# EAGLE design PCB-TLY-JACK (EAGLE 7.5.0)

## Sheet 1 of 2
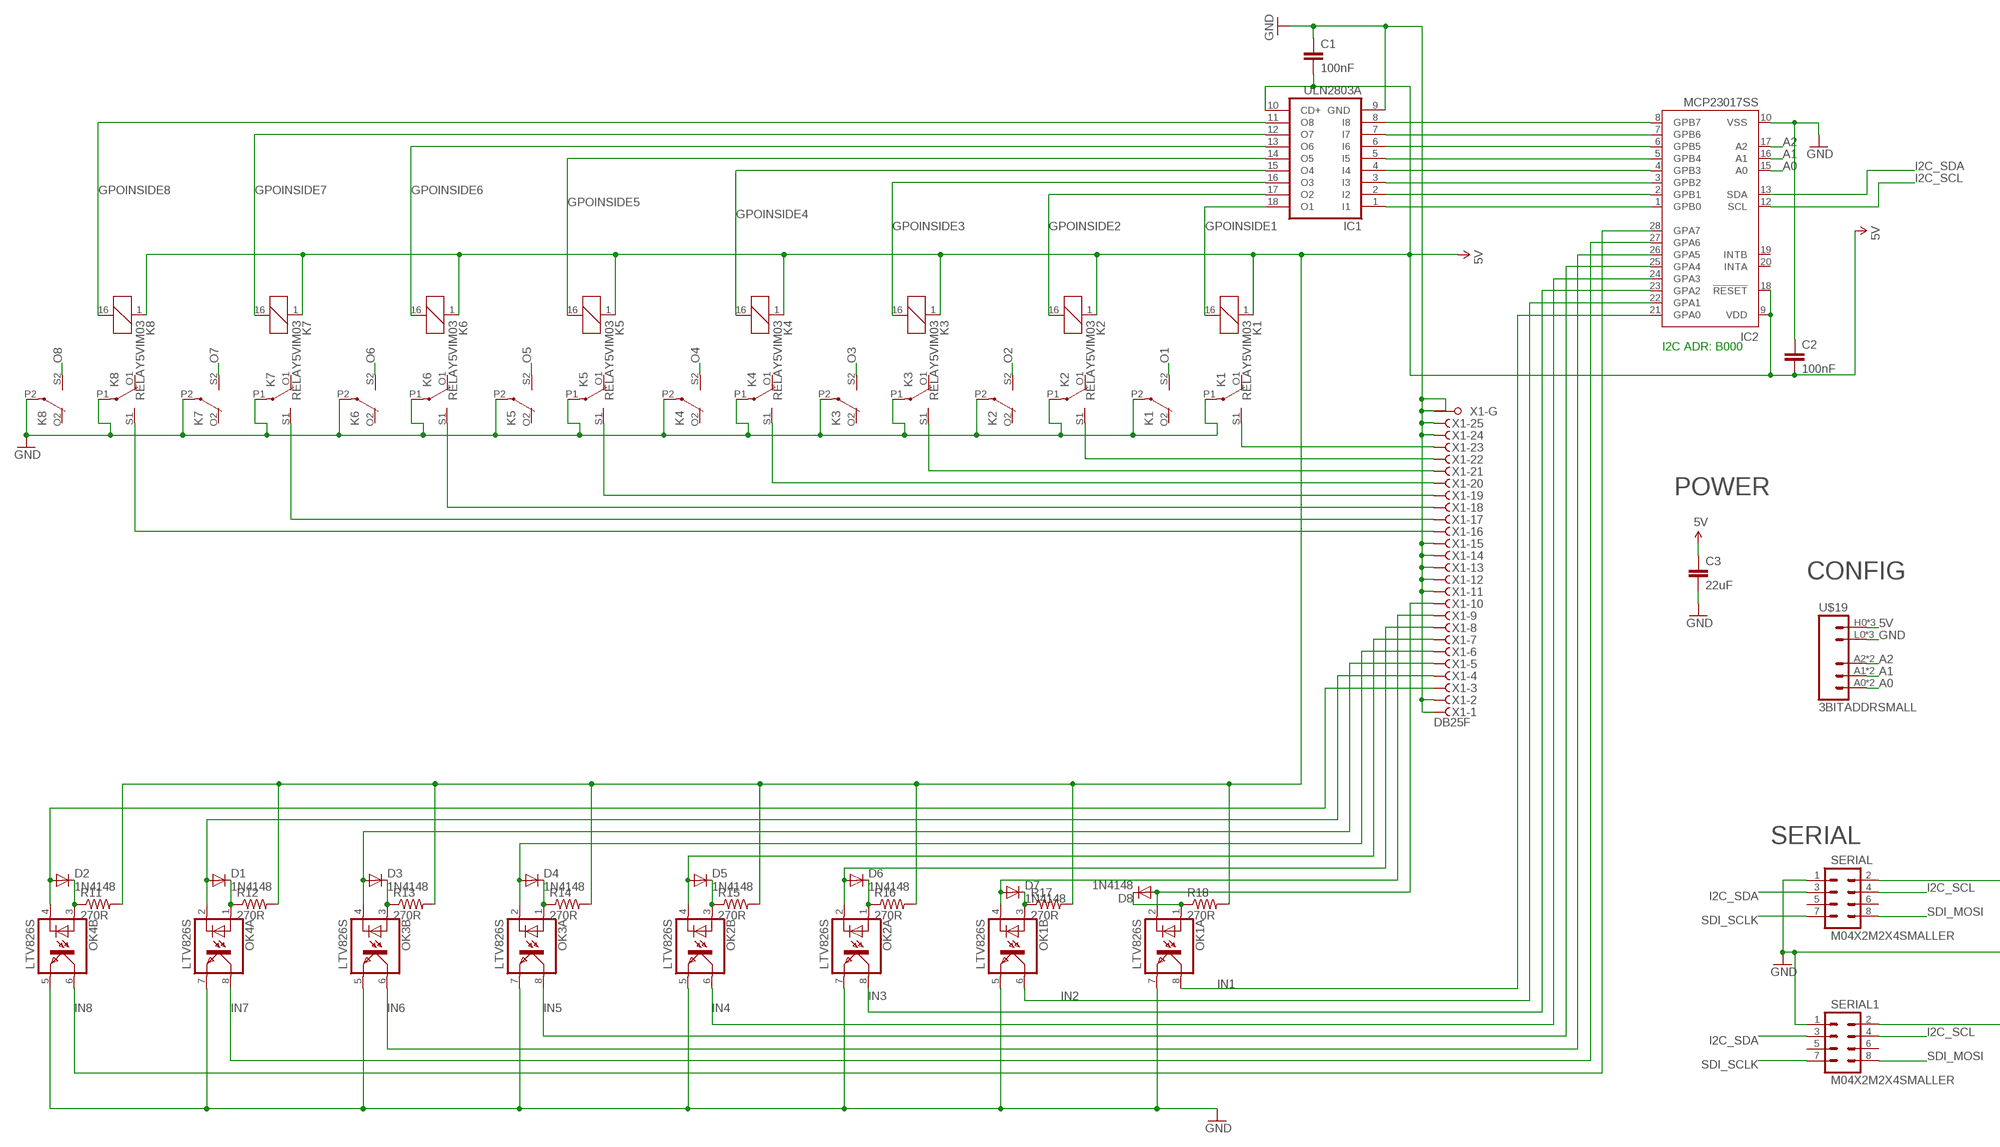
[diagram p0: schematic, sheet 1, part 1 of 2]
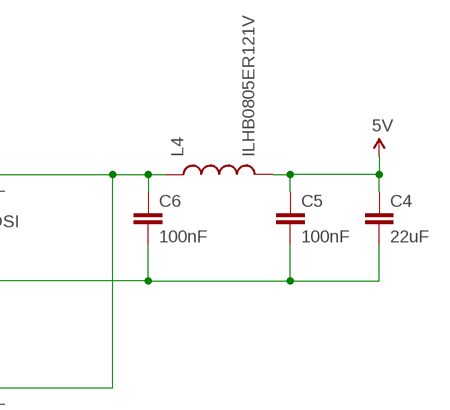
[diagram p1: schematic, sheet 1, part 2 of 2]

### Parts
C1  100nF  CAP0603-CAP  [0603-CAP]
C2  100nF  CAP0603-CAP  [0603-CAP]
C3  22uF  CAP0805  [0805]
C4  22uF  CAP0805  [0805]
C5  100nF  CAP0603-CAP  [0603-CAP]
C6  100nF  CAP0603-CAP  [0603-CAP]
D1  1N4148  DIODESOD  [SOD-323]
D2  1N4148  DIODESOD  [SOD-323]
D3  1N4148  DIODESOD  [SOD-323]
D4  1N4148  DIODESOD  [SOD-323]
D5  1N4148  DIODESOD  [SOD-323]
D6  1N4148  DIODESOD  [SOD-323]
D7  1N4148  DIODESOD  [SOD-323]
D8  1N4148  DIODESOD  [SOD-323]
IC1  ULN2803A  ULN2803ASO18W  [SO18W]
IC2  MCP23017SS  [SSOP28]
K1  RELAY5VIM03  [DS2Y]
K2  RELAY5VIM03  [DS2Y]
K3  RELAY5VIM03  [DS2Y]
K4  RELAY5VIM03  [DS2Y]
K5  RELAY5VIM03  [DS2Y]
K6  RELAY5VIM03  [DS2Y]
K7  RELAY5VIM03  [DS2Y]
K8  RELAY5VIM03  [DS2Y]
L4  ILHB0805ER121V  INDUCTOR0805  [0805]
OK1  LTV826S  [DIL8-SMD]
OK2  LTV826S  [DIL8-SMD]
OK3  LTV826S  [DIL8-SMD]
OK4  LTV826S  [DIL8-SMD]
R11  270R  RESISTOR0603-RES  [0603-RES]
R12  270R  RESISTOR0603-RES  [0603-RES]
R13  270R  RESISTOR0603-RES  [0603-RES]
R14  270R  RESISTOR0603-RES  [0603-RES]
R15  270R  RESISTOR0603-RES  [0603-RES]
R16  270R  RESISTOR0603-RES  [0603-RES]
R17  270R  RESISTOR0603-RES  [0603-RES]
R18  270R  RESISTOR0603-RES  [0603-RES]
SERIAL  M04X2M2X4SMALLER  [M2X4SMALLER]
SERIAL1  M04X2M2X4SMALLER  [M2X4SMALLER]
U$19  3BITADDRSMALL  [3BITADDR_SMALL]
X1  DB25F  F25HPS  [F25HP]

### Nets
5V [Power]: C1.2 C2.2 C3.1 C4.1 C5.1 IC1.10(CD+) IC2.9(VDD) IC2.18(!RESET) K1.1 K2.1 K3.1 K4.1 K5.1 K6.1 K7.1 K8.1 L4.2 R11.2 R12.2 R13.2 R14.2 R15.2 R16.2 R17.2 R18.2 U$19.H0(VCC) U$19.H1(VCC) U$19.H2(VCC)
A0: IC2.15(A0) U$19.A0 U$19.AS0(A0)
A1: IC2.16(A1) U$19.A1 U$19.AS1(A1)
A2: IC2.17(A2) U$19.A2 U$19.AS2(A2)
GND [Power]: C1.1 C2.1 C3.2 C4.2 C5.2 C6.2 IC1.9(GND) IC2.10(VSS) K1.P1(2:P) K1.P2(3:P) K2.P1(2:P) K2.P2(3:P) K3.P1(2:P) K3.P2(3:P) K4.P1(2:P) K4.P2(3:P) K5.P1(2:P) K5.P2(3:P) K6.P1(2:P) K6.P2(3:P) K7.P1(2:P) K7.P2(3:P) K8.P1(2:P) K8.P2(3:P) OK1.5(B:EMIT) OK1.7(A:EMIT) OK2.5(B:EMIT) OK2.7(A:EMIT) OK3.5(B:EMIT) OK3.7(A:EMIT) OK4.5(B:EMIT) OK4.7(A:EMIT) SERIAL1.1 SERIAL.1 U$19.L0(GND) U$19.L1(GND) U$19.L2(GND) X1.1(-1:F) X1.2(-2:F) X1.11(-11:F) X1.12(-12:F) X1.13(-13:F) X1.14(-14:F) X1.15(-15:F) X1.24(-24:F) X1.25(-25:F) X1.G1(-G:G1) X1.G2(-G:G2)
GPOINSIDE1: IC1.18(O1) K1.16
GPOINSIDE2: IC1.17(O2) K2.16
GPOINSIDE3: IC1.16(O3) K3.16
GPOINSIDE4: IC1.15(O4) K4.16
GPOINSIDE5: IC1.14(O5) K5.16
GPOINSIDE6: IC1.13(O6) K6.16
GPOINSIDE7: IC1.12(O7) K7.16
GPOINSIDE8: IC1.11(O8) K8.16
I2C_SCL: IC2.12(SCL) SERIAL1.4 SERIAL.4
I2C_SDA: IC2.13(SDA) SERIAL1.3 SERIAL.3
IN1: IC2.21(GPA0) OK1.8(A:COL)
IN2: IC2.22(GPA1) OK1.6(B:COL)
IN3: IC2.23(GPA2) OK2.8(A:COL)
IN4: IC2.24(GPA3) OK2.6(B:COL)
IN5: IC2.25(GPA4) OK3.8(A:COL)
IN6: IC2.26(GPA5) OK3.6(B:COL)
IN7: IC2.27(GPA6) OK4.8(A:COL)
IN8: IC2.28(GPA7) OK4.6(B:COL)
N$1 [RELAY LINES]: K1.S1(2:S) X1.23(-23:F)
N$2 [Power]: C6.1 L4.1 SERIAL1.2 SERIAL.2
N$5: IC1.1(I1) IC2.1(GPB0)
N$6 [RELAY LINES]: K2.S1(2:S) X1.22(-22:F)
N$10 [RELAY LINES]: K3.S1(2:S) X1.21(-21:F)
N$13: D2.1(C) OK4.3(B:A) R11.1
N$14 [RELAY LINES]: K4.S1(2:S) X1.20(-20:F)
N$15: D1.1(C) OK4.1(A:A) R12.1
N$16: D3.1(C) OK3.3(B:A) R13.1
N$17: D4.1(C) OK3.1(A:A) R14.1
N$18 [RELAY LINES]: K5.S1(2:S) X1.19(-19:F)
N$19: D5.1(C) OK2.3(B:A) R15.1
N$20: D6.1(C) OK2.1(A:A) R16.1
N$21: D7.1(C) OK1.3(B:A) R17.1
N$22 [RELAY LINES]: K6.S1(2:S) X1.18(-18:F)
N$23: D8.1(C) OK1.1(A:A) R18.1
N$26 [RELAY LINES]: K7.S1(2:S) X1.17(-17:F)
N$30 [RELAY LINES]: K8.S1(2:S) X1.16(-16:F)
N$34: IC1.2(I2) IC2.2(GPB1)
N$35: IC1.3(I3) IC2.3(GPB2)
N$36: IC1.4(I4) IC2.4(GPB3)
N$37: IC1.5(I5) IC2.5(GPB4)
N$38: IC1.6(I6) IC2.6(GPB5)
N$39: IC1.7(I7) IC2.7(GPB6)
N$40: IC1.8(I8) IC2.8(GPB7)
N$49 [INput lines]: D8.2(A) OK1.2(A:C) X1.10(-10:F)
N$55 [INput lines]: D4.2(A) OK3.2(A:C) X1.6(-6:F)
N$60 [INput lines]: D7.2(A) OK1.4(B:C) X1.9(-9:F)
N$61 [INput lines]: D6.2(A) OK2.2(A:C) X1.8(-8:F)
N$62 [INput lines]: D5.2(A) OK2.4(B:C) X1.7(-7:F)
N$64 [INput lines]: D3.2(A) OK3.4(B:C) X1.5(-5:F)
N$65 [INput lines]: D1.2(A) OK4.2(A:C) X1.4(-4:F)
N$66 [INput lines]: D2.2(A) OK4.4(B:C) X1.3(-3:F)
O1: K1.S2(3:S)
O2: K2.S2(3:S)
O3: K3.S2(3:S)
O4: K4.S2(3:S)
O5: K5.S2(3:S)
O6: K6.S2(3:S)
O7: K7.S2(3:S)
O8: K8.S2(3:S)
SDI_MOSI: SERIAL1.8 SERIAL.8
SDI_SCLK: SERIAL1.7 SERIAL.7
Unconnected: IC2.19(INTB) IC2.20(INTA) K1.O1(2:O) K1.O2(3:O) K2.O1(2:O) K2.O2(3:O) K3.O1(2:O) K3.O2(3:O) K4.O1(2:O) K4.O2(3:O) K5.O1(2:O) K5.O2(3:O) K6.O1(2:O) K6.O2(3:O) K7.O1(2:O) K7.O2(3:O) K8.O1(2:O) K8.O2(3:O) SERIAL1.5 SERIAL1.6 SERIAL.5 SERIAL.6

### Notes on the sheet
- I2C ADR: B000
- POWER
- CONFIG
- SERIAL

## Sheet 2 of 2

## Library data of the parts
C1-C6 = SparkFun:CAP: Capacitor Standard 0603 ceramic capacitor, and 0.1" leaded capacitor.
D1-D8 = SparkFun:DIODE: Diode These are standard reverse protection diodes and small signal diodes. SMA package can handle up to about 1A. SOD-323 can handle about 200mA. What the SOD-323 package when ordering, there are some mfgs out there that are 5-pin packages.
IC1 = uln-udn:ULN2803A: DRIVER ARRAY
IC2 = microchip:MCP23017: http://ww1.microchip.com/downloads/en/DeviceDoc/21952a.pdf Source: http://ww1.microchip.com/downloads/en/DeviceDoc/21952a.pdf; MF: MICROCHIP; MPN: MCP23017-E/SS; OC_FARNELL: 1467674; OC_NEWARK: 31K2960
K1-K8 = SKAARHOJ:RELAY5V: RELAY 2 x switch, AxiCom 150 mW 5V
L4 = SparkFun:INDUCTOR: Inductors Basic Inductor/Choke - 0603 and 1206. Footprints are not proven and vary greatly between part numbers.
OK1-OK4 = optocoupler:LTV826: OPTO COUPLER Source: LITEON, LTV816.pdf; OC_FARNELL: unknown; OC_NEWARK: unknown
R11-R18 = SparkFun:RESISTOR: Resistor Basic schematic elements and footprints for 0603, 1206, and PTH resistors.
SERIAL SERIAL1 = SKAARHOJ:M04X2
U$19 = SKAARHOJ:3BITADDR
X1 = con-subd:F25HPS: SUB-D; OC_FARNELL: unknown; OC_NEWARK: unknown

## Net classes
0 default: width 0.203 mm, drill 0.406 mm, clearance 0.203 mm
1 Power: width 0.406 mm, drill 0.61 mm, clearance 0.203 mm
2 RELAY LINES: width 0.305 mm, drill 0.406 mm, clearance 0.254 mm
3 INput lines: width 0.203 mm, drill 0.406 mm, clearance 0.254 mm

## Board
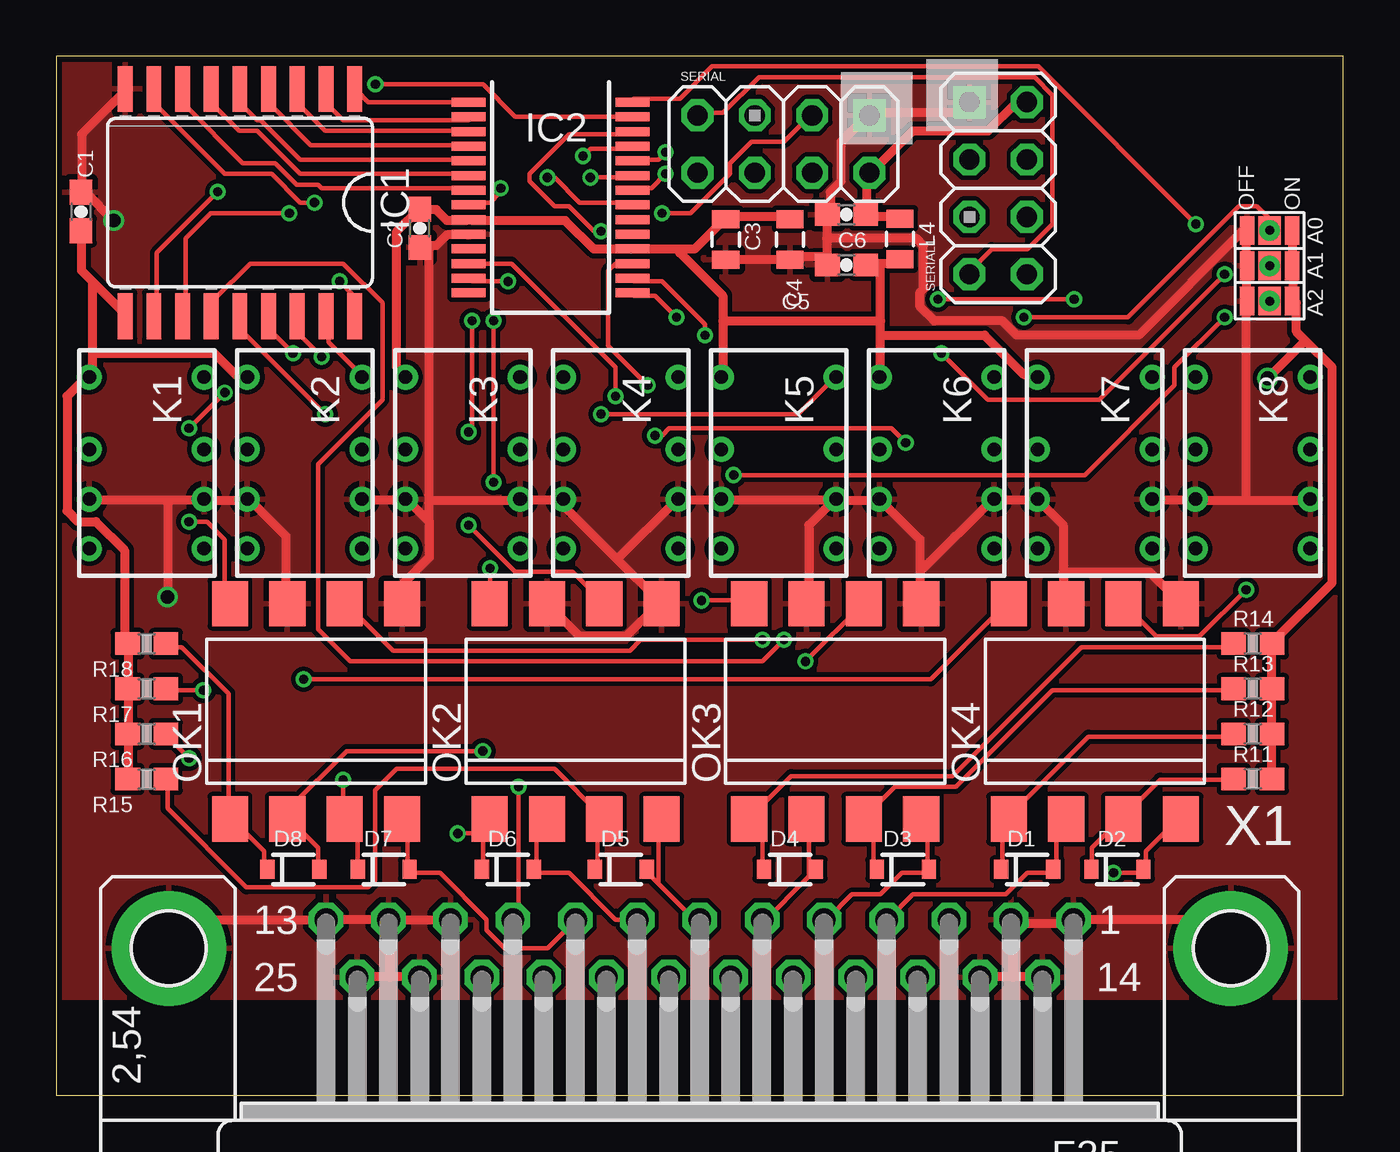
[diagram p2: board, top side]
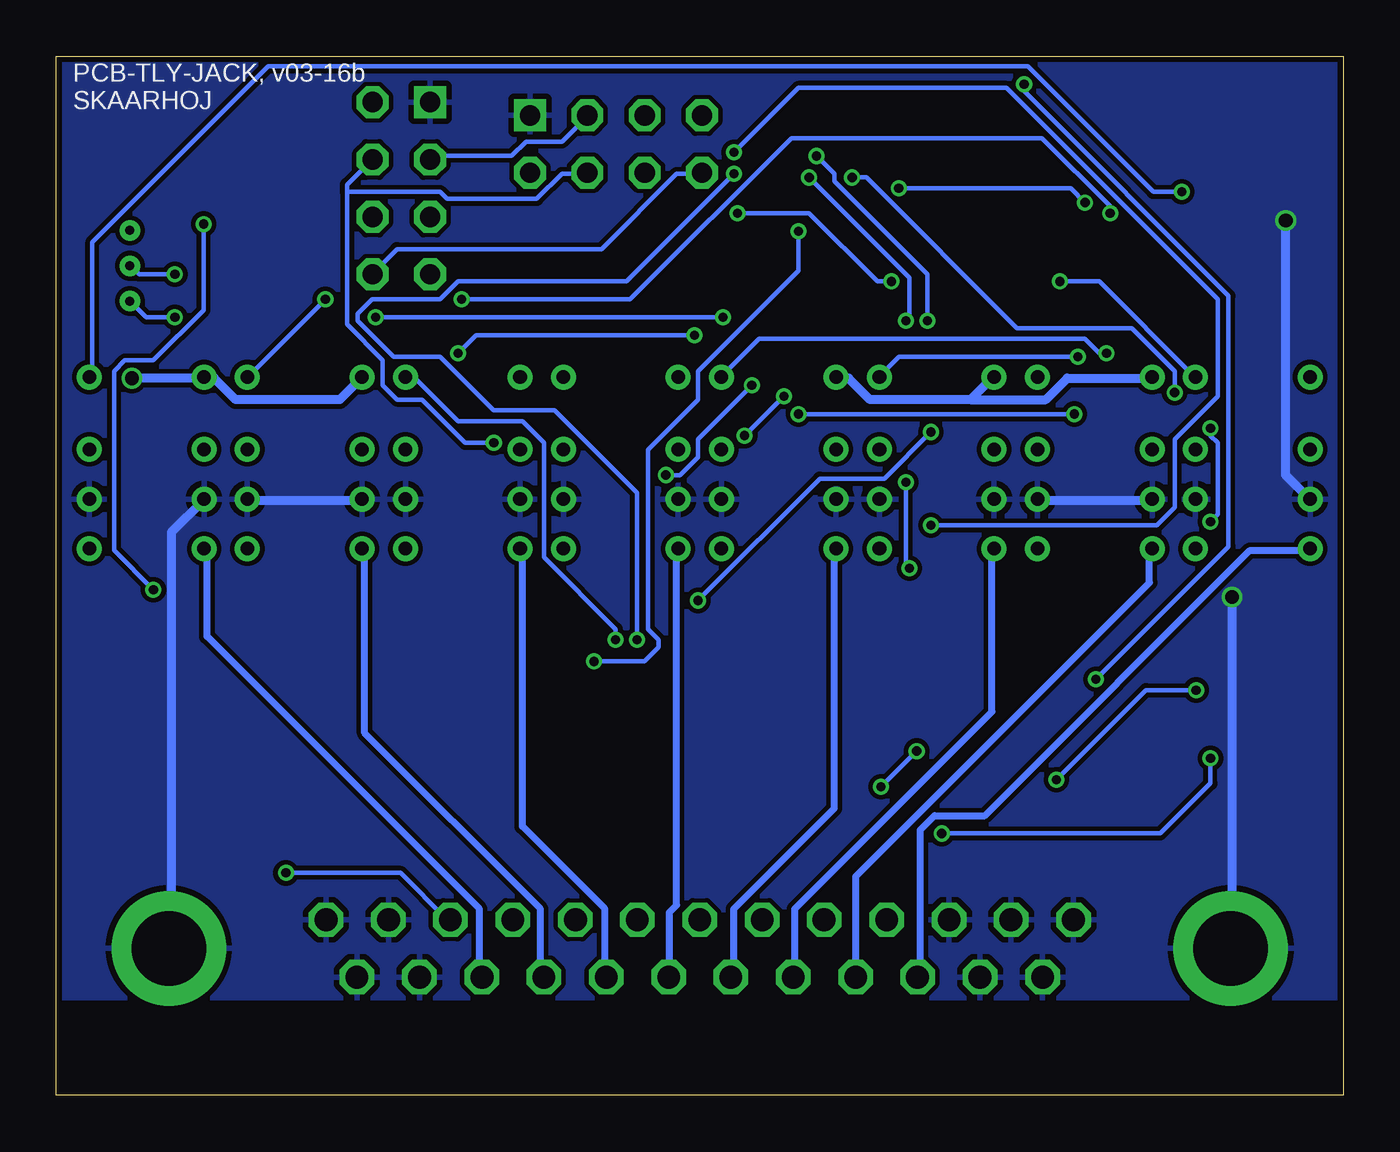
[diagram p3: board, bottom side, seen from below]

Size 57 x 46 mm. Coordinates in mm from the lower left corner, seen from the top.
Outline: 57,0 57,46 0,46 0,0 57,0
Copper layers (1*16): Top 0.035mm / dielectric 1.5mm / Bottom 0.035mm
Design rules "Fusion_eagle_rule_v1.1": minimum track width 6mil, minimum drill 12mil, track to track 6mil, track to pad 6mil, pad to pad 6mil, via to via 6mil, smd to smd 0mil, copper to edge 10mil, drill to drill 10mil, minimum pad ring 10mil, minimum via ring 6mil, stop-mask expansion 2mil, vias tented up to drill 100mil, thermal gap 10mil
tRestrict: area 0,0 to 57,4
bRestrict: area 0,0 to 57,4

### Footprints (pad centres in the part's own frame; a part is rotated, then mirrored left to right if it is on the bottom)
0603-CAP = smd 1.1 x 1: 1 -0.85,0; 2 0.85,0
0805 = smd 0.8 x 1.2: 1 -0.9,0; 2 0.9,0
SOD-323 = smd 0.63 x 0.83: 1 -1.15,0; 2 1.15,0
SO18W = smd 0.66 x 2.032: 1 -5.08,-5.029; 2 -3.81,-5.029; 3 -2.54,-5.029; 4 -1.27,-5.029; 5 0,-5.029; 6 1.27,-5.029; 7 2.54,-5.029; 8 3.81,-5.029; 9 5.08,-5.029; 10 5.08,5.029; 11 3.81,5.029; 12 2.54,5.029; 13 1.27,5.029; 14 0,5.029; 15 -1.27,5.029; 16 -2.54,5.029; 17 -3.81,5.029; 18 -5.08,5.029
SSOP28 = smd 0.4 x 1.5: 1 -4.225,-3.625; 2 -3.575,-3.625; 3 -2.925,-3.625; 4 -2.275,-3.625; 5 -1.625,-3.625; 6 -0.975,-3.625; 7 -0.325,-3.625; 8 0.325,-3.625; 9 0.975,-3.625; 10 1.625,-3.625; 11 2.275,-3.625; 12 2.925,-3.625; 13 3.575,-3.625; 14 4.225,-3.625; 15 4.225,3.625; 16 3.575,3.625; 17 2.925,3.625; 18 2.275,3.625; 19 1.625,3.625; 20 0.975,3.625; 21 0.325,3.625; 22 -0.325,3.625; 23 -0.975,3.625; 24 -1.625,3.625; 25 -2.275,3.625; 26 -2.925,3.625; 27 -3.575,3.625; 28 -4.225,3.625
DS2Y = drill 0.6: 1 1.2,0.46; 16 1.2,5.54; O1 4.4,0.46; O2 4.4,5.54; P1 6.6,0.46; P2 6.6,5.54; S1 8.8,0.46; S2 8.8,5.54
DIL8-SMD = smd 1.6 x 2: 1 -3.81,-4.77; 2 -1.27,-4.77; 3 1.27,-4.77; 4 3.81,-4.77; 5 3.81,4.77; 6 1.27,4.77; 7 -1.27,4.77; 8 -3.81,4.77
0603-RES = smd 1.1 x 1: 1 -0.85,0; 2 0.85,0
M2X4SMALLER = drill 0.9 square: 1 -1.27,3.81 | drill 0.9 octagon: 2 1.27,3.81; 3 -1.27,1.27; 4 1.27,1.27; 5 -1.27,-1.27; 6 1.27,-1.27; 7 -1.27,-3.81; 8 1.27,-3.81
3BITADDR_SMALL = drill 0.4: A0 -1.565,0; A1 0,0; A2 1.565,0 | smd 1.27 x 1: AS0 -1.565,0; AS1 0,0; AS2 1.565,0 | smd 1.27 x 0.635: H0 -1.565,1; H1 0,1; H2 1.565,1; L0 -1.565,-1; L1 0,-1; L2 1.565,-1
F25HP = drill 1.016 octagon: 1 -16.561,-1.27; 2 -13.792,-1.27; 3 -11.049,-1.27; 4 -8.28,-1.27; 5 -5.512,-1.27; 6 -2.769,-1.27; 7 0,-1.27; 8 2.769,-1.27; 9 5.512,-1.27; 10 8.28,-1.27; 11 11.049,-1.27; 12 13.792,-1.27; 13 16.561,-1.27; 14 -15.189,1.27; 15 -12.421,1.27; 16 -9.652,1.27; 17 -6.909,1.27; 18 -4.14,1.27; 19 -1.372,1.27; 20 1.372,1.27; 21 4.14,1.27; 22 6.909,1.27; 23 9.652,1.27; 24 12.421,1.27; 25 15.189,1.27 | drill 3.302 pad 5.08: G1 -23.52,0; G2 23.52,0

### Placement (x,y rotation side)
C1  1.09,39.13 270 top
C2  16.1,38.39 90 top
C3  29.65,37.9 270 top
C4  32.49,37.9 270 top
C5  35,36.77 180 top
C6  35,39 180 top
D1  43,10 0 top
D2  47,10 0 top
D3  37.5,10 0 top
D4  32.5,10 0 top
D5  25,10 0 top
D6  20,10 0 top
D7  14.5,10 0 top
D8  10.5,10 0 top
IC1  8.13,39.53 180 top
IC2  21.89,39.75 270 top
K1  1,33 270 top
K2  8,33 270 top
K3  15,33 270 top
K4  22,33 270 top
K5  29,33 270 top
K6  36,33 270 top
K7  43,33 270 top
K8  50,33 270 top
L4  37.37,37.91 270 top
OK1  11.5,17 0 top
OK2  23,17 0 top
OK3  34.5,17 0 top
OK4  46,17 0 top
R11  53,14 0 top
R12  53,16 0 top
R13  53,18 0 top
R14  53,20 0 top
R15  4,14 180 top
R16  4,16 180 top
R17  4,18 180 top
R18  4,20 180 top
SERIAL  32.21,42.12 270 top
SERIAL1  41.72,40.17 0 top
U$19  53.75,36.73 270 top
X1  28.5,6.5 180 top

### Tracks (layer width: path | path; a pad name or v marks a point on that pad's centre or on a via)
5V  (via drill 0.61)
  Top 0.406: R15.2 3.17,14.13 3.17,15.88 R16.2 3.17,16.19 3.17,17.94 R17.2 3.17,18.1 3.17,19.84 R18.2 3.02,20.16 3.02,24.13 1.75,25.4 0.95,25.4 0.48,25.88 0.48,30.96 1.27,31.75 K1.1 1.59,31.91 1.59,32.86 | 1.67,35.96 3.02,34.61 IC1.10 | 1.67,35.96 1.11,36.51 1.11,38.26 C1.2 | 1.59,32.86 1.59,35.88 1.67,35.96 | 1.59,32.86 6.99,32.86 7.94,31.91 8.41,31.91 K2.1 | U$19.H0 54.77,38.26 54.77,36.83 U$19.H1 54.77,36.67 54.77,35.24 U$19.H2 54.93,35.08 54.93,33.81 55.32,33.42 | R11.2 53.82,14.13 53.82,15.88 R12.2 53.82,16.19 53.82,17.94 R13.2 53.82,18.1 53.82,19.84 R14.2 53.98,20.16 56.52,22.7 56.52,32.23 55.32,33.42 | 36.51,36.83 37.15,36.83 37.31,36.99 L4.2 | 36.51,36.83 35.88,36.83 C5.1 | 36.51,33.66 36.51,31.91 K6.1 | 36.51,33.66 36.51,34.29 | 36.51,34.29 36.51,36.83 | 36.51,33.66 41.12,33.66 42.86,31.91 43.34,31.91 K7.1 | K3.1 15.4,31.91 15.08,32.23 15.08,38.26 16.03,39.21 C2.2 16.19,39.21 16.83,39.21 17.3,38.73 18.1,38.73 IC2.9 18.41,38.73 22.54,38.73 23.81,37.47 25.4,37.47 IC2.18 25.56,37.47 27.62,37.47 | C4.1 32.38,38.89 29.69,38.89 C3.1 29.53,38.73 28.26,37.47 27.62,37.47 | 29.53,34.29 29.53,35.4 27.62,37.31 27.62,37.47 | 29.53,34.29 29.53,31.91 K5.1 | 29.53,34.29 36.51,34.29 | v53.66,31.75 55.32,33.42
  Bottom 0.406: K7.1 43.5,31.75 44.45,30.8 49.05,30.8 50.01,31.75 50.32,31.75 K8.1 50.64,31.75 v53.66,31.75 | 16.51,30.8 20.95,30.8 21.91,31.75 22.38,31.75 K4.1 | 16.51,30.8 15.56,31.75 K3.1 | 16.51,30.8 13.18,30.8 12.22,31.75 8.57,31.75 K2.1
A0  (via drill 0.41)
  Top 0.203: 53.82,38.26 U$19.AS0 53.66,38.42 53.66,38.89 53.18,39.37 52.39,39.37 47.47,34.45 v42.86,34.45 | v27.46,34.45 26.51,35.4 25.56,35.4 IC2.15
  Bottom 0.203: v42.86,34.45 v27.46,34.45
A1  (via drill 0.41)
  Top 0.203: 53.82,36.67 U$19.AS1 | v28.73,33.66 28.73,34.13 26.83,36.04 25.56,36.04 IC2.16 | v39.21,32.86 41.27,30.8 46.2,30.8 v51.75,36.35
  Bottom 0.203: v28.73,33.66 38.42,33.66 v39.21,32.86 | v51.75,36.35 53.34,36.35 53.66,36.67 U$19.AS1
A2  (via drill 0.41)
  Top 0.203: 53.82,35.24 U$19.AS2 | v26.19,31.43 24.45,33.18 24.45,36.51 24.77,36.83 25.4,36.83 IC2.17 | v30,27.46 45.56,27.46 49.53,31.43 49.53,32.23 v51.75,34.45
  Bottom 0.203: v26.19,31.43 28.57,29.05 28.57,28.26 29.37,27.46 v30,27.46 | v51.75,34.45 53.02,34.45 53.66,35.08 U$19.AS2
GND  (via drill 0.61)
  Top 0.406: 14.76,5.24 16.03,5.24 X1.24 | 14.76,5.24 13.34,5.24 X1.25 | X1.12 14.61,7.78 12.06,7.78 X1.13 11.75,7.78 6.35,7.78 5.08,6.51 X1.G2 | X1.11 17.3,7.78 14.76,7.78 X1.12 | 14.76,5.24 14.76,7.62 X1.12 | OK1.7 10.16,21.91 10.16,24.77 8.57,26.35 K2.P1 8.41,26.35 6.67,26.35 K1.P2 6.51,26.35 4.92,26.35 | IC1.9 3.02,44.45 1.11,42.55 1.11,40.01 C1.1 1.27,40.01 v2.54,38.73 | 4.92,26.35 1.59,26.35 K1.P1 | 4.92,26.35 v4.92,22.07 | 44.61,23.18 44.61,25.24 43.5,26.35 K7.P1 43.34,26.35 41.59,26.35 K6.P2 41.43,26.35 38.42,23.34 38.26,23.34 | 44.61,23.18 44.61,21.91 OK4.7 | 44.61,23.18 48.42,23.18 49.69,21.91 OK4.5 | 38.26,23.34 38.26,24.61 36.51,26.35 K6.P1 36.35,26.35 34.61,26.35 K5.P2 | 38.26,23.34 38.26,21.91 OK3.5 | OK3.7 33.34,21.91 33.34,25.24 34.45,26.35 K5.P2 | K5.P2 34.29,26.35 29.53,26.35 K5.P1 29.37,26.35 27.62,26.35 K4.P2 27.46,26.35 24.84,23.73 | OK2.7 21.75,21.75 23.18,20.32 25.24,20.32 26.67,21.75 OK2.5 26.67,21.91 24.84,23.73 | IC2.10 18.26,38.1 17.3,38.1 16.83,37.62 16.19,37.62 C2.1 16.51,37.47 16.51,26.35 | 16.51,25.4 16.51,23.81 15.4,22.7 15.4,21.91 OK1.5 | 16.51,25.4 15.56,26.35 K3.P1 15.4,26.35 13.65,26.35 K2.P2 | 16.51,25.4 16.51,26.35 | 16.51,26.35 20.48,26.35 K3.P2 20.64,26.35 22.38,26.35 K4.P1 22.38,26.19 24.84,23.73 | 42.39,5.24 43.66,5.24 X1.14 | 42.39,5.24 40.96,5.24 X1.15 | 42.39,5.24 42.39,7.62 X1.2 42.55,7.62 44.93,7.62 X1.1 45.24,7.78 50.64,7.78 51.91,6.51 X1.G1 | 34.13,37.94 34.13,38.89 C6.2 34.29,39.05 34.29,40.01 34.77,40.48 34.77,42.23 35.88,43.34 SERIAL.1 36.04,43.5 39.85,43.5 40.32,43.97 SERIAL1.1 | 34.13,37.94 34.13,36.83 C5.2 33.97,37.15 32.54,37.15 C4.2 32.38,36.99 29.69,36.99 C3.2
  Top 0.406: K7.P2 48.58,26.35 50.32,26.35 K8.P1 50.64,26.35 52.7,26.35 | 52.7,26.35 55.4,26.35 K8.P2 | 52.7,26.35 52.7,35.08 U$19.L2 52.7,35.24 52.7,36.67 U$19.L1 52.7,36.83 52.7,38.26 U$19.L0 52.55,38.26 47.94,33.66 42.55,33.66 41.91,34.29 38.89,34.29 38.26,34.92 38.26,35.56 38.42,35.72 38.42,37.62 38.1,37.94 34.13,37.94
  Bottom 0.406: v2.54,38.73 2.54,27.46 1.59,26.51 K1.P1 | v4.92,22.07 4.92,6.51 X1.G2 | X1.G1 51.91,6.51 51.91,24.92 50.48,26.35 K8.P1 | K7.P1 43.5,26.35 48.42,26.35 K7.P2 | K2.P1 8.57,26.35 13.49,26.35 K2.P2
  pour Top: 0,0 57,0 57,46 0,46
  pour Bottom: 0,0 57,0 57,46 0,46
GPOINSIDE1  (via drill 0.41)
  Top 0.203: v12.54,36.04 13.18,35.4 13.18,34.61 IC1.18
  Bottom 0.203: v12.54,36.04 10.79,36.04 6.67,31.91 K1.16
GPOINSIDE2
  Top 0.203: IC1.17 12.06,34.45 12.06,33.34 13.49,31.91 K2.16
GPOINSIDE3  (via drill 0.41)
  Top 0.203: v11.75,32.7 10.79,33.66 10.79,34.45 IC1.16
  Bottom 0.203: v11.75,32.7 19.68,32.7 20.48,31.91 K3.16
GPOINSIDE4  (via drill 0.41)
  Top 0.203: v10.48,32.86 9.53,33.81 9.53,34.45 IC1.15
  Bottom 0.203: v10.48,32.86 10.79,32.86 11.43,33.5 25.88,33.5 27.46,31.91 K4.16
GPOINSIDE5  (via drill 0.41)
  Top 0.203: v11.91,30.16 8.26,33.81 8.26,34.45 IC1.14 | v24.13,30.16 32.86,30.16 34.45,31.75 K5.16
  Bottom 0.203: v24.13,30.16 v11.91,30.16
GPOINSIDE6  (via drill 0.41)
  Top 0.203: v32.23,20.16 31.27,19.21 13.02,19.21 11.59,20.64 11.59,27.94 14.45,30.8 14.45,35.08 12.7,36.83 8.57,36.83 6.99,35.24 6.99,34.61 IC1.13
  Bottom 0.203: v32.23,20.16 32.23,20.64 35.4,23.81 35.4,28.89 36.35,29.84 39.21,29.84 41.12,31.75 41.43,31.75 K6.16
GPOINSIDE7  (via drill 0.41)
  Top 0.203: v10.32,39.05 6.83,39.05 5.71,37.94 5.71,34.61 IC1.12 | v45.09,35.24 v39.05,35.24
  Bottom 0.203: v10.32,39.05 10.32,39.37 13.34,42.39 24.45,42.39 31.59,35.24 v39.05,35.24 | v45.09,35.24 48.42,31.91 K7.16
GPOINSIDE8  (via drill 0.41)
  Top 0.203: v7.14,40.01 4.45,37.31 4.45,34.61 IC1.11
  Bottom 0.203: v7.14,40.01 8.41,40.01 13.97,45.56 47.62,45.56 55.4,37.78 55.4,31.91 K8.16
I2C_SCL  (via drill 0.41)
  Top 0.203: v24.77,30.96 24.77,32.23 20.16,36.83 18.41,36.83 IC2.12 | v26.51,29.21 26.83,29.21 27.15,29.53 36.99,29.53 v37.62,28.89
  Bottom 0.203: v26.51,29.21 v24.77,30.96 | v37.62,28.89 38.89,28.89 40.8,30.8 41.91,30.8 42.55,31.43 42.55,32.54 44.13,34.13 44.13,40.01 | 44.13,40.01 44.13,40.32 43.02,41.43 SERIAL1.4 | 44.13,40.01 40.01,40.01 39.69,39.69 35.72,39.69 34.61,40.8 33.5,40.8 SERIAL.4
I2C_SDA  (via drill 0.41)
  Top 0.203: v20,36.04 18.41,36.04 IC2.13 | v26.83,39.05 28.1,39.05 29.84,40.8 29.84,41.27 30.8,42.23 32.23,42.23 33.34,43.34 SERIAL.3
  Bottom 0.203: v20,36.04 20.64,36.04 23.65,39.05 v26.83,39.05 | SERIAL1.3 40.32,41.59 36.83,41.59 36.2,42.23 34.61,42.23 33.5,43.34 SERIAL.3
IN1  (via drill 0.41)
  Top 0.203: v21.75,40.64 22.07,40.64 23.18,39.53 25.4,39.53 IC2.21 | v5.87,29.53 v7.46,31.11 | v5.87,25.4 6.67,25.4 7.46,24.61 7.46,22.07 7.62,21.91 OK1.8
  Bottom 0.203: v21.75,40.64 21.11,40.64 14.45,33.97 9.37,33.97 7.46,32.07 v7.46,31.11 | v5.87,29.53 5.87,29.21 5.56,28.89 5.56,25.72 v5.87,25.4
IN2  (via drill 0.41)
  Top 0.203: v26.99,40.8 26.35,40.16 25.56,40.16 IC2.22 | v31.27,20.16 25.88,20.16 25.4,19.68 14.92,19.68 12.86,21.75 OK1.6
  Bottom 0.203: v26.99,40.8 31.75,36.04 39.21,36.04 40.01,35.24 43.02,35.24 43.66,34.61 43.66,34.29 42.07,32.7 40.01,32.7 37.62,30.32 34.92,30.32 31.27,26.67 v31.27,20.16
IN3  (via drill 0.41)
  Top 0.203: v23.65,40.64 25.4,40.64 IC2.23 | v19.37,27.15 v19.37,34.29 | v19.21,23.34 19.21,21.91 OK2.8
  Bottom 0.203: v23.65,40.64 19.21,36.2 19.21,34.45 v19.37,34.29 | v19.37,27.15 19.37,23.5 v19.21,23.34
IN4  (via drill 0.41)
  Top 0.203: v26.99,41.75 26.67,41.43 25.56,41.43 IC2.24 | v18.26,25.24 20.32,23.18 22.86,23.18 24.13,21.91 OK2.6
  Bottom 0.203: v26.99,41.75 24.13,44.61 14.92,44.61 5.56,35.24 5.56,30.96 7.46,29.05 7.46,26.04 8.26,25.24 v18.26,25.24
IN5  (via drill 0.41)
  Top 0.203: v23.34,41.59 23.65,41.91 25.4,41.91 IC2.25 | v18.41,34.29 18.41,29.53 v18.26,29.37 | v28.57,21.91 30.64,21.91 OK3.8
  Bottom 0.203: v23.34,41.59 22.54,40.8 22.54,40.48 18.41,36.35 v18.41,34.29 | v18.26,29.37 20.32,27.3 23.18,27.3 v28.57,21.91
IN6  (via drill 0.41)
  Top 0.203: v24.13,38.26 23.81,38.26 22.7,39.37 22.07,39.37 20.95,40.48 20.95,40.8 22.7,42.55 25.4,42.55 IC2.26 | v33.18,19.21 35.72,21.75 OK3.6
  Bottom 0.203: v24.13,38.26 24.13,36.51 28.57,32.07 28.57,30.8 30.8,28.57 30.8,20.64 30.32,20.16 30.32,19.84 30.96,19.21 v33.18,19.21
IN7  (via drill 0.41)
  Top 0.203: v14.13,44.77 18.89,44.77 20.32,43.34 25.4,43.34 IC2.27 | v10.95,18.41 38.73,18.41 42.07,21.75 OK4.8
  Bottom 0.203: v14.13,44.77 14.13,44.45 5.08,35.4 5.08,24.29 v10.95,18.41
IN8  (via drill 0.41)
  Top 0.203: v50.48,38.58 43.5,45.56 29.05,45.56 27.62,44.13 25.56,44.13 IC2.28 | v52.7,22.38 50.64,20.32 48.74,20.32 47.31,21.75 OK4.6
  Bottom 0.203: v50.48,38.58 50.48,34.77 52.7,32.54 53.98,32.54 54.45,32.07 54.45,24.13 v52.7,22.38
N$1
  Bottom 0.305: K1.S1 1.59,24.13 4.13,24.13 15.88,12.38 18.1,12.38 18.73,11.75 18.73,5.24 X1.23
N$2
  Top 0.406: L4.1 37.31,38.89 35.88,38.89 C6.1 35.88,39.21 35.88,40.8 SERIAL.2 36.2,40.96 37.94,42.7 41.27,42.7 42.55,43.97 42.86,43.97 SERIAL1.2
N$5
  Top 0.203: IC2.1 18.26,43.97 13.81,43.97 13.34,44.45 IC1.1
N$6
  Bottom 0.305: K2.S1 8.57,24.13 8.57,22.7 21.59,9.68 X1.22
N$10
  Bottom 0.305: K3.S1 15.56,24.13 15.56,16.99 24.29,8.26 24.29,5.24 X1.21
N$13
  Top 0.203: D2.1 45.88,10 45.88,10.95 47.15,12.22 OK4.3 47.31,12.38 48.9,13.97 52.07,13.97 R11.1
N$14
  Bottom 0.305: K4.S1 22.54,24.13 22.54,12.7 26.99,8.26 26.99,5.24 X1.20
N$15
  Top 0.203: D1.1 41.91,10 41.91,12.06 42.07,12.22 OK4.1 42.23,12.38 45.72,15.88 52.07,15.88 R12.1
N$16
  Top 0.203: D3.1 36.2,10 36.2,11.91 35.88,12.22 OK3.3 35.88,12.38 37.15,13.65 39.85,13.65 44.13,17.94 52.07,17.94 R13.1
N$17
  Top 0.203: D4.1 31.27,10 31.27,11.75 30.8,12.22 OK3.1 30.8,12.38 32.54,14.13 39.69,14.13 45.4,19.84 52.07,19.84 R14.1
N$18
  Bottom 0.305: K5.S1 29.53,24.13 29.53,8.41 29.84,8.1 29.84,5.24 X1.19
N$19
  Top 0.203: D5.1 23.97,10 23.97,12.06 24.13,12.22 OK2.3 24.13,12.38 22.07,14.45 15.08,14.45 14.13,13.49 14.13,9.53 13.81,9.21 8.41,9.21 4.92,12.7 4.92,13.97 R15.1
N$20  (via drill 0.41)
  Top 0.203: 18.89,11.59 18.89,12.06 19.05,12.22 OK2.1 18.89,11.59 | 18.89,11.59 18.89,10 D6.1 | v5.87,14.92 4.92,15.88 R16.1 | 18.89,11.59 v17.78,11.59
  Bottom 0.203: v5.87,14.92 5.87,13.81 8.1,11.59 v17.78,11.59
N$21  (via drill 0.41)
  Top 0.203: D7.1 13.34,10 13.34,11.75 12.86,12.22 OK1.3 12.7,12.38 v12.7,13.97 | v6.51,17.94 4.92,17.94 R17.1
  Bottom 0.203: v6.51,17.94 8.73,17.94 v12.7,13.97
N$22
  Bottom 0.305: K6.S1 36.35,24.13 36.35,11.91 32.7,8.26 32.7,5.24 X1.18
N$23
  Top 0.203: D8.1 9.21,10 9.21,10.79 7.78,12.22 OK1.1 7.62,12.38 7.62,17.78 5.56,19.84 4.92,19.84 R18.1
N$26
  Bottom 0.305: K7.S1 43.34,24.13 43.34,16.03 35.56,8.26 35.56,5.24 X1.17
N$30
  Bottom 0.305: K8.S1 50.32,24.13 50.32,20.32 38.26,8.26 38.26,5.24 X1.16
N$34
  Top 0.203: IC2.2 18.26,43.18 12.7,43.18 12.06,43.81 12.06,44.45 IC1.2
N$35
  Top 0.203: IC2.3 18.26,42.7 11.91,42.7 10.79,43.81 10.79,44.45 IC1.3
N$36
  Top 0.203: IC2.4 18.26,42.07 11.27,42.07 9.53,43.81 9.53,44.45 IC1.4
N$37
  Top 0.203: IC2.5 18.26,41.43 10.79,41.43 9.05,43.18 8.89,43.18 8.26,43.81 8.26,44.45 IC1.5
N$38
  Top 0.203: IC2.6 18.26,40.8 10.79,40.8 8.89,42.7 8.1,42.7 6.99,43.81 6.99,44.45 IC1.6
N$39
  Top 0.203: IC2.7 18.26,40.16 11.75,40.16 11.59,40.32 10.64,40.32 9.68,41.27 8.26,41.27 5.71,43.81 5.71,44.45 IC1.7
N$40  (via drill 0.41)
  Top 0.203: v19.68,40.16 19.68,40.01 19.21,39.53 18.41,39.53 IC2.8 | v11.43,39.53 10.79,39.53 9.53,40.8 7.46,40.8 4.45,43.81 4.45,44.45 IC1.8
  Bottom 0.203: v19.68,40.16 12.06,40.16 v11.43,39.53
N$49  (via drill 0.41)
  Top 0.203: D8.2 11.59,10 11.59,10.95 10.32,12.22 OK1.2 10.32,12.38 10.32,12.7 12.86,15.24 v18.89,15.24 | v20.48,13.65 20.48,7.94 20.32,7.78 X1.10
  Bottom 0.203: v20.48,13.65 v18.89,15.24
N$55
  Top 0.203: 33.34,9.68 31.27,7.62 X1.6 | 33.34,9.68 33.5,9.84 D4.2 33.34,9.68 | 33.34,9.68 33.34,12.22 OK3.2
N$60
  Top 0.203: OK1.4 15.4,12.22 15.56,12.06 15.56,10 D7.2 15.72,9.84 16.99,9.84 19.05,7.78 19.05,7.3 19.84,6.51 21.75,6.51 22.86,7.62 X1.9
N$61
  Top 0.203: OK2.2 21.59,12.22 21.27,11.91 21.27,10 D6.2 21.27,9.84 22.7,9.84 24.77,7.78 25.72,7.78 X1.8
N$62
  Top 0.203: 26.67,9.37 28.42,7.62 X1.7 | 26.67,9.37 26.19,9.84 D5.2 | 26.67,9.37 26.67,12.22 OK2.4
N$64
  Top 0.203: OK3.4 38.42,12.22 38.58,12.06 38.58,10 D3.2 38.58,9.84 37.47,9.84 36.51,8.89 35.24,8.89 34.13,7.78 X1.5
N$65
  Top 0.203: OK4.2 44.61,12.22 44.29,11.91 44.29,10 D1.2 44.13,9.84 43.02,9.84 42.07,8.89 37.94,8.89 36.83,7.78 X1.4
N$66  (via drill 0.41)
  Top 0.203: OK4.4 49.69,12.22 48.26,10.79 48.26,10 D2.2 48.1,9.84 v46.83,9.84
  Bottom 0.203: v46.83,9.84 41.75,9.84 39.69,7.78 X1.3
SDI_MOSI
  Bottom 0.203: SERIAL.8 28.42,40.8 29.53,40.8 32.86,37.47 41.91,37.47 42.86,36.51 SERIAL1.8
SDI_SCLK
  Top 0.203: SERIAL.7 28.42,43.5 29.53,43.5 31.11,45.09 43.34,45.09 44.13,44.29 44.13,38.58 43.02,37.47 41.43,37.47 40.48,36.51 SERIAL1.7

### Text on the board
_bsilk: PCB-TLY-JACK, v03-16b / SKAARHOJ